# Altium schematic sheet MCU.SchDoc: Wacky Hat MCU
size A3; Author: Jack Duignan; DrawnBy: JDU & EWI; Organization: Group 33; Address1: ECE Department; Address2: University of Canterbury; Address3: Christchurch 8041; Address4: New Zealand; DocumentNumber: 001; Revision: 1; SheetNumber: 1; SheetTotal: 3; ImagePath: \\maxwell\elecapp\AltiumDesigner\Templates\uc-logo.png
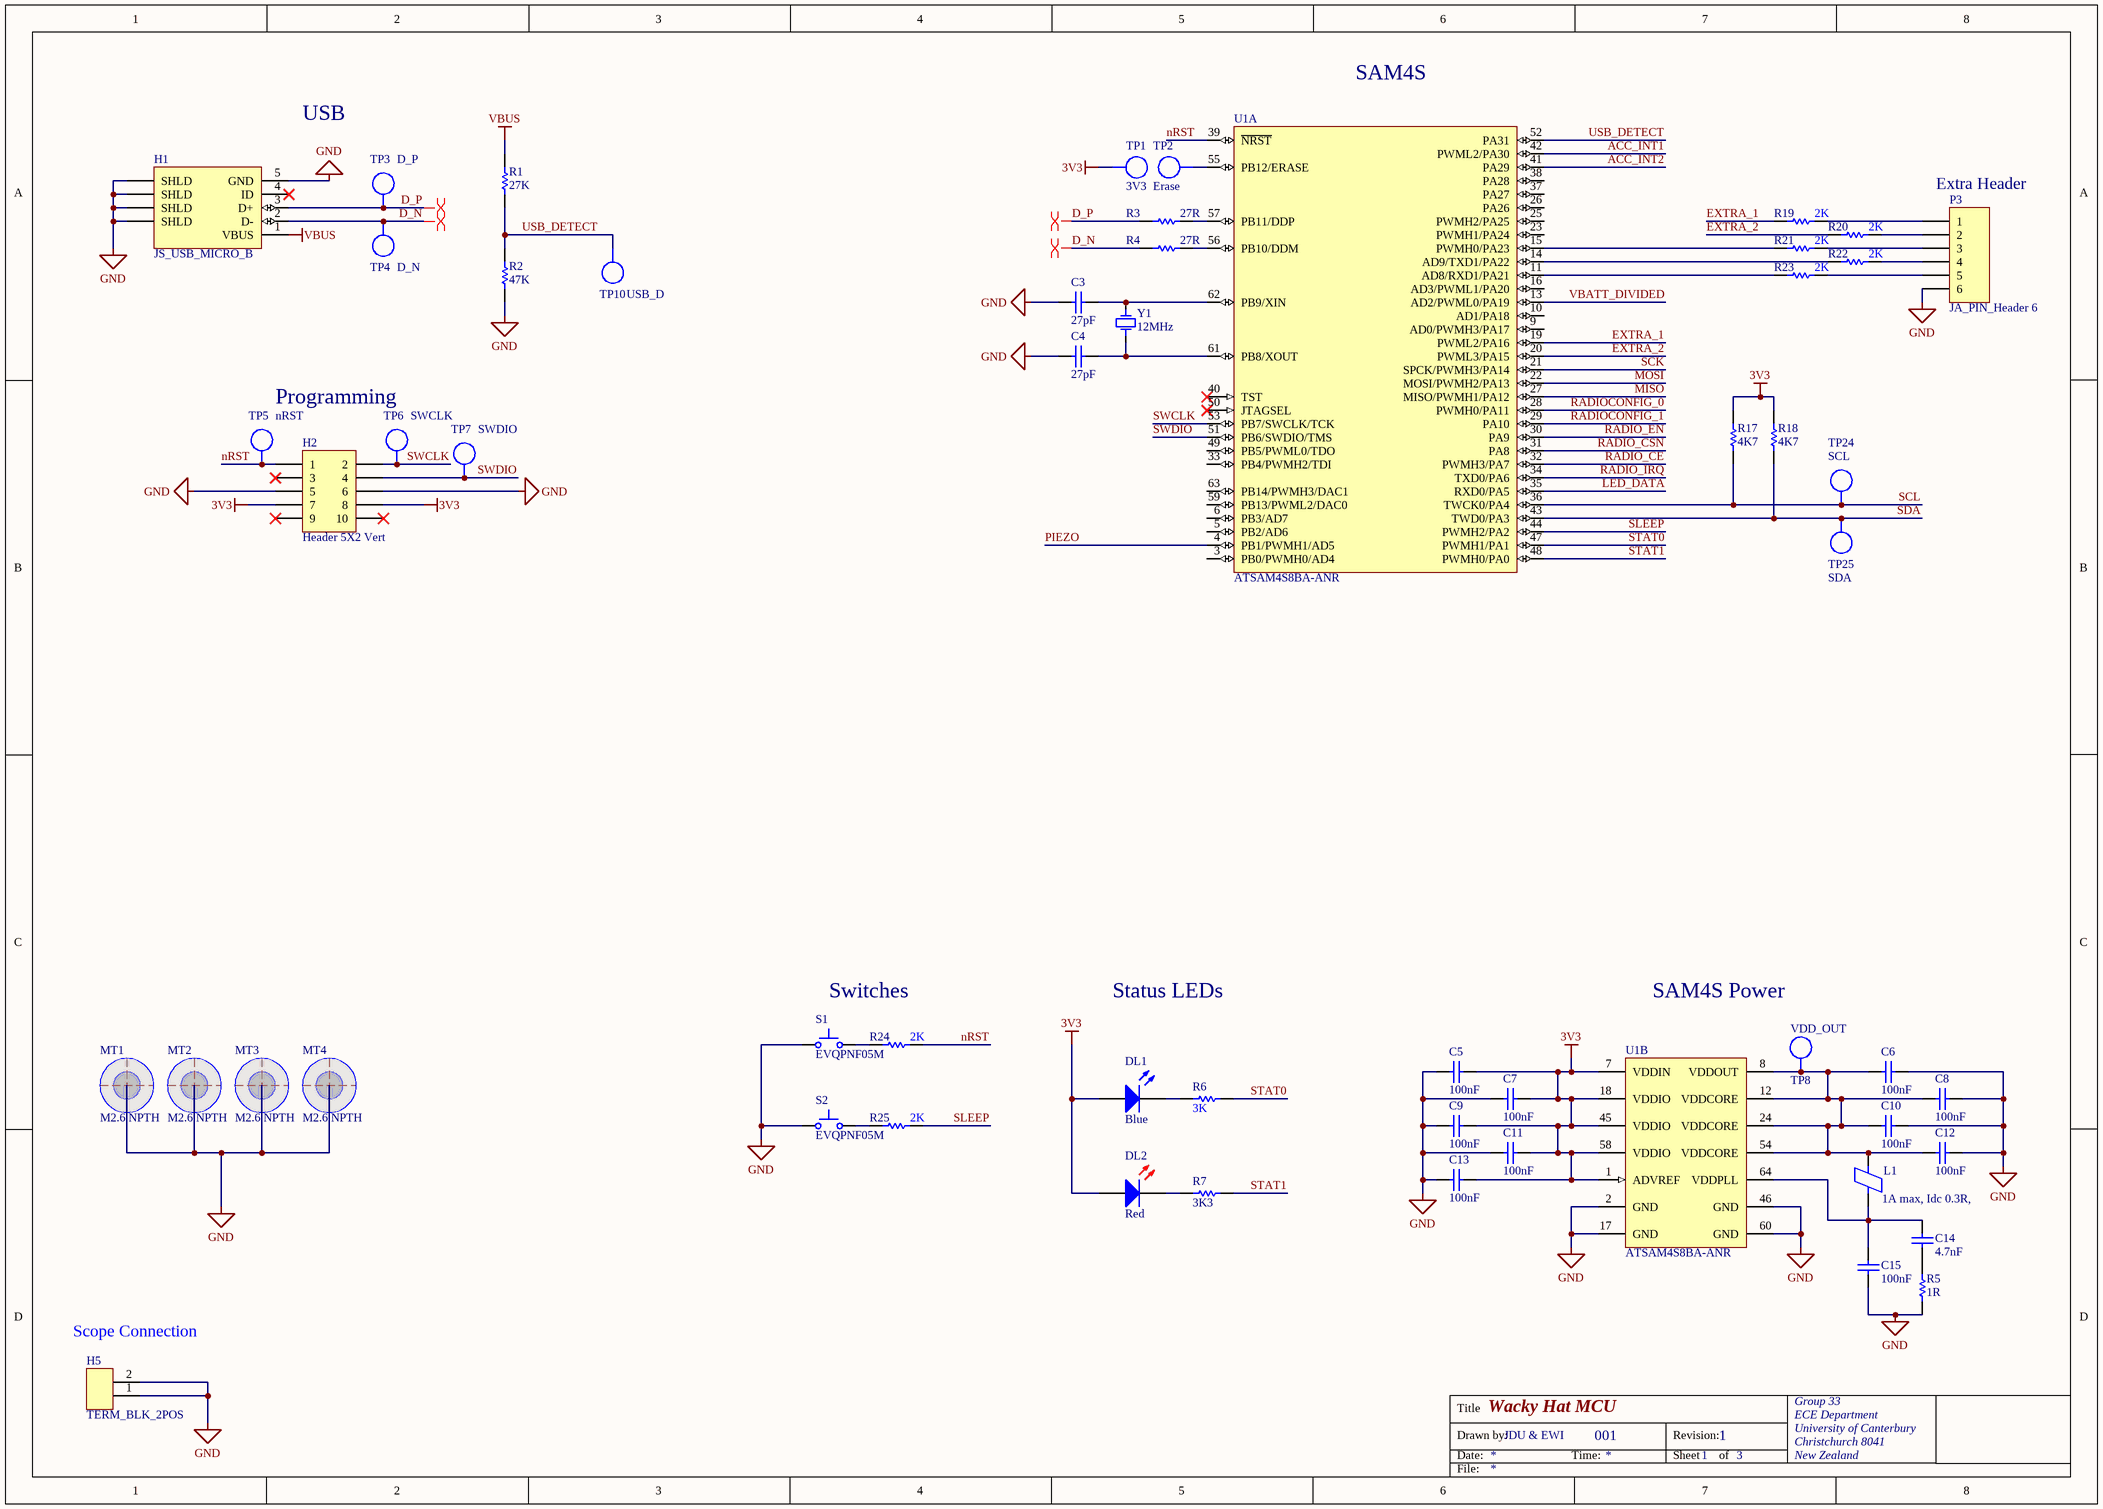
[diagram p0: MCU.SchDoc]

## Parts
C3  27pF  [CAPC1608L]
C4  27pF  [CAPC1608L]
C5  100nF  [CAPC1608L]
C6  100nF  [CAPC1608L]
C7  100nF  [CAPC1608L]
C8  100nF  [CAPC1608L]
C9  100nF  [CAPC1608L]
C10  100nF  [CAPC1608L]
C11  100nF  [CAPC1608L]
C12  100nF  [CAPC1608L]
C13  100nF  [CAPC1608L]
C14  4.7nF  [CAPC1608L]
C15  100nF  [CAPC1608L]
DL1  Blue  [WL-SMCW0603]
DL2  Red  [WL-SMCW0603]
H1  JS_USB_MICRO_B  [FCI_USB_10118194-0001LF]
H2  Header 5X2 Vert  [IDC2.54-V10D]
H5  TERM_BLK_2POS  [TERM_BLK_2POS]
L1  1A max, Idc 0.3R,  [INDC3216L]
MT1  M2.6 NPTH  [MNT-HOLE_2.6mm_NPTH]  (no BOM)
MT2  M2.6 NPTH  [MNT-HOLE_2.6mm_NPTH]  (no BOM)
MT3  M2.6 NPTH  [MNT-HOLE_2.6mm_NPTH]  (no BOM)
MT4  M2.6 NPTH  [MNT-HOLE_2.6mm_NPTH]  (no BOM)
P3  JA_PIN_Header 6  [HDR1X6]
R1  27K  [RESC1608L]
R2  47K  [RESC1608N]
R3  27R  [RESC1608L]
R4  27R  [RESC1608L]
R5  1R  [RESC3216L]
R6  3K  [RESC1608L]
R7  3K3  [RESC1608L]
R17  4K7  [RESC1608L]
R18  4K7  [RESC1608L]
R19  2K  [RESC1608L]
R20  2K  [RESC1608L]
R21  2K  [RESC1608L]
R22  2K  [RESC1608L]
R23  2K  [RESC1608L]
R24  2K  [RESC1608L]
R25  2K  [RESC1608L]
S1  EVQPNF05M  [EVQPNF05M]
S2  EVQPNF05M  [EVQPNF05M]
TP1  3V3  [TP_1206]  (no BOM)
TP2  Erase  [TP_1206]  (no BOM)
TP3  D_P  [TP_1206]  (no BOM)
TP4  D_N  [TP_1206]  (no BOM)
TP5  nRST  [TP_1206]  (no BOM)
TP6  SWCLK  [TP_1206]  (no BOM)
TP7  SWDIO  [TP_1206]  (no BOM)
TP8  VDD_OUT  [TP_1206]  (no BOM)
TP10  USB_D  [TP_1206]  (no BOM)
TP24  SCL  [TP_1206]  (no BOM)
TP25  SDA  [TP_1206]  (no BOM)
U1  ATSAM4S8BA-ANR  [LQFP64_L]  (parts A,B of 2)
Y1  12MHz  [6.0X3.5-4]

## Nets
3V3: C5.2 C7.2 C9.2 C11.2 C13.2 DL1.2(A) DL2.2(A) H2.7 H2.8 R17.2 R18.2 TP1.1 U1.1(ADVREF) U1.7(VDDIN) U1.18(VDDIO) U1.45(VDDIO) U1.58(VDDIO)
GND: C3.1 C4.1 C5.1 C6.2 C7.1 C8.2 C9.1 C10.2 C11.1 C12.2 C13.1 C15.1 H1.5(GND) H1.6(SHLD) H2.5 H2.6 H5.1 H5.2 P3.6 R2.1 R5.1 S1.1 S2.1 U1.2(GND) U1.17(GND) U1.46(GND) U1.60(GND)
VBUS: H1.1(VBUS) R1.2
ACC_INT1: U1.42(PWML2/PA30)
ACC_INT2: U1.41(PA29)
D_N: H1.2(D-) R4.1 TP4.1
D_P: H1.3(D+) R3.1 TP3.1
EXTRA_1: R19.1 U1.19(PWML2/PA16)
EXTRA_2: R20.1 U1.20(PWML3/PA15)
LED_DATA: U1.35(RXD0/PA5)
MISO: U1.27(MISO/PWMH1/PA12)
MOSI: U1.22(MOSI/PWMH2/PA13)
nRST: H2.1 R24.2 TP5.1 U1.39(~{NRST})
PIEZO: U1.4(PB1/PWMH1/AD5)
RADIO_CE: U1.32(PWMH3/PA7)
RADIO_CSN: U1.31(PA8)
RADIO_EN: U1.30(PA9)
RADIO_IRQ: U1.34(TXD0/PA6)
RADIOCONFIG_0: U1.28(PWMH0/PA11)
RADIOCONFIG_1: U1.29(PA10)
SCK: U1.21(SPCK/PWMH3/PA14)
SCL: R17.1 TP24.1 U1.36(TWCK0/PA4)
SDA: R18.1 TP25.1 U1.43(TWD0/PA3)
SLEEP: R25.2 U1.44(PWMH2/PA2)
STAT0: R6.2 U1.47(PWMH1/PA1)
STAT1: R7.2 U1.48(PWMH0/PA0)
SWCLK: H2.2 TP6.1 U1.53(PB7/SWCLK/TCK)
SWDIO: H2.4 TP7.1 U1.51(PB6/SWDIO/TMS)
USB_DETECT: R1.1 R2.2 TP10.1 U1.52(PA31)
VBATT_DIVIDED: U1.13(AD2/PWML0/PA19)
NetC3_2: C3.2 U1.62(PB9/XIN) Y1.3(OSC2)
NetC4_2: C4.2 U1.61(PB8/XOUT) Y1.1(OSC1)
NetC6_1: C6.1 C8.1 C10.1 C12.1 L1.2 TP8.1 U1.8(VDDOUT) U1.12(VDDCORE) U1.24(VDDCORE) U1.54(VDDCORE)
NetC14_1: C14.1 R5.2
NetC14_2: C14.2 C15.2 L1.1 U1.64(VDDPLL)
NetDL1_1: DL1.1(K) R6.1
NetDL2_1: DL2.1(K) R7.1
NetP3_1: P3.1 R19.2
NetP3_2: P3.2 R20.2
NetP3_3: P3.3 R21.2
NetP3_4: P3.4 R22.2
NetP3_5: P3.5 R23.2
NetR3_2: R3.2 U1.57(PB11/DDP)
NetR4_2: R4.2 U1.56(PB10/DDM)
NetR21_1: R21.1 U1.15(PWMH0/PA23)
NetR22_1: R22.1 U1.14(AD9/TXD1/PA22)
NetR23_1: R23.1 U1.11(AD8/RXD1/PA21)
NetR24_1: R24.1 S1.2
NetR25_1: R25.1 S2.2
NetTP2_1: TP2.1 U1.55(PB12/ERASE)

Not connected (* = marked no-connect by the designer): H1 4(ID)*; H2 3* 9* 10*; U1 3(PB0/PWMH0/AD4) 5(PB2/AD6) 6(PB3/AD7) 9(AD0/PWMH3/PA17) 10(AD1/PA18) 16(AD3/PWML1/PA20) 23(PWMH1/PA24) 25(PWMH2/PA25) 26(PA26) 33(PB4/PWMH2/TDI) 37(PA27) 38(PA28) 40(TST)* 49(PB5/PWML0/TDO) 50(JTAGSEL)* 59(PB13/PWML2/DAC0) 63(PB14/PWMH3/DAC1)

## Layout directives
differential pair: D_N, D_P

## Notes on the sheet
- SAM4S
- USB
- (near P3) Extra Header
- Programming
- Switches
- Status LEDs
- SAM4S Power
- (near H5) Scope Connection
- Title
- Drawn by:
- Date:
- Time:
- Revision:
- Sheet
- of
- File:

## Library data of the parts
C3 C4 = CC_27pF_0603: CAP CER 27pF NPO/COG +-5% 50V 0603; PackageReference: 0603; Code_IPC: 1608 [0603]; Verify: *; Supplier: ECE Dept; Storage Location: PCB Assembly WS; Value: 27pF
C5-C13 C15 = CC_100nF_0603: CAP CER 100nF X7R +-10% 50V 0603; PackageReference: 0603; Code_IPC: 1608 [0603]; Verify: *; Supplier: ECE Dept; Storage Location: PCB Assembly WS; Value: 100nF
C14 = CC_4.7nF_0603: CAP CER 4.7nF X7R +-10% 50V 0603; PackageReference: 0603; Code_IPC: 1608 [0603]; Verify: *; Supplier: ECE Dept; Storage Location: PCB Assembly WS; Value: 4.7nF
DL1 = DL_150060BS75000: LED Blue 270mcd 0603 SMD; Manufacturer: WURTH ELEKTRONIK; Forward Current If: 30; Forward Voltage: 3.2; Luminous Intensity: 270; Viewing Angle: 120°; Wavelength Typ: 470; Pricing: 1=0.3844, 50=0.3252, 100=0.2957, 500=0.2365 (NZD); Supplier 1: Farnell; Supplier Part Number 1: 2322069; Manufacturer Part Number: 150060BS75000; Storage Location: PCB Assembly WS; Supplier: ECE Dept; LED Colour: Blue
DL2 = DL_150060RS75000: LED Red 250mcd 0603 SMD; Manufacturer: WURTH ELEKTRONIK; Forward Current If: 30; Forward Voltage: 2; Lens Shape: Rectangular; Luminous Intensity: 250; Wavelength Typ: 625; Viewing Angle: 140°; LED Mounting: SMD; Supplier 1: Farnell; Supplier Part Number 1: 2322071; Manufacturer Part Number: 150060RS75000; Storage Location: PCB Assembly WS; Supplier: ECE Dept; LED Colour: Red
H1 = JS_USB_MICRO_B_SMT: CONN USB MICRO B RECPT SMT R/A; Manufacturer: FCI; Manufacturer Part Number: 10118194-0001LF; Gender: Receptacle; Number of Contacts: 5; Specifications: USB 2.0; Supplier 1: Digi-Key; Supplier Part Number 1: 609-4618-1-ND; Features: Shielded, Solder Retention; Mounting Type: Surface Mount, Right Angle, Horizontal
H2 = JA_HDR_IDC_5X2_VERT: IDC Header, 2,54mm, 10-Pin, Vert; Supplier: ECE Dept; Supplier 1: Farnell; Supplier Part Number 1: 1096985; Storage Location: ECE Dept Store
H5 = TERM_BLK_2POS: 2 Position Terminal Block 7.62mm spacing
L1 = IN_Ferrite-Bead: Ferrite Bead, Rdc 0.3R, Z100MHZ 600R, Imax 1A, SMD 1206; Manufacturer: FAIR-RITE; Manufacturer PN: 2512066017Y1; DC Current Rating: 1; DC Resistance Max: 0.08; Ferrite Case Style: 1206 ^3216 Metric]; Frequency Range: 50MHz to 1; Impedance: 600; Impedance Tolerance: ± 25%; Supplier: ECE Dept; Storage Location: PCB Assembly WS; Ferrite Mounting: SMD; Supplier 1: Farnell; Supplier Part Number 1: 1612060; Manufacturer Part Number: 2512066017Y1; Value: 1A max, Idc 0.3R,
MT1-MT4 = MC_M2.6_HOLE: Fixing M2.6 Mount Hole NPTH; Manufacturer: Hi-Q; Manufacturer PN: 2BV series M2.5 Clearance; price: 0; Supplier: ECE Dept; value: M2.6 NPTH
P3 = JA_PIN_Header 6: Header, 6-Pin; LatestRevisionDate: 17-Jul-2002; LatestRevisionNote: Re-released for DXP Platform.; Publisher: Altium Limited
R1 = RS_27K: RES 27K OHM 1/10W 5% 0603 SMD; Storage Location: PCB Assembly WS; Supplier: ECE Dept; Value: 27K
R2 = RS_47K: RES 47.0K OHM 1/10W 5% 0603 SMD; Storage Location: PCB Assembly WS; Supplier: ECE Dept; Value: 47K
R3 R4 = RS_27R: RES 27 OHM 1/10W 5% 0603 SMD; Storage Location: PCB Assembly WS; Supplier: ECE Dept; Value: 27R
R5 = RT_1R: RES 1R OHM 1/4W 5% 1206 SMD; Storage Location: PCB Assembly WS; Supplier: ECE Dept; Value: 1R
R6 = RS_3K: RES 3K OHM 1/10W 5% 0603 SMD; Storage Location: PCB Assembly WS; Supplier: ECE Dept; Value: 3K
R7 = RS_1K5: RES 1.5K OHM 1/10W 5% 0603 SMD; Storage Location: PCB Assembly WS; Supplier: ECE Dept; Value: 3K3
R17 R18 = RS_4K7: RES 4.7K OHM 1/10W 5% 0603 SMD; Storage Location: PCB Assembly WS; Supplier: ECE Dept; Value: 4K7
R19-R25 = RS_2K: RES 2K OHM 1/10W 5% 0603 SMD; Storage Location: PCB Assembly WS; Supplier: ECE Dept; Value: 2K
S1 S2 = WS_EVQPNF05M: Panasonic 6 x 3.5mm SMD Light Touch Switch Type SMD; PackageDescription: 6.0 x 3.5 mm; Supplier 1: Farnell; Supplier Part Number 1: 2079481; Manufacturer: Panasonic; Manufacturer PN: EVQPNF05M; Supplier 2: Digi-Key; Supplier Part Number 2: P13598SCT-ND; Storage Location: PCB Assembly WS; Supplier: ECE Dept
TP1-TP8 TP10 TP24 TP25 = TP_1206: Test-Point 3.3x1.6x2.1mm SMD; Manufacturer: Harwin Inc; Manufacturer Part Number: S1751-46R; Value: TP; Manufacturer PN: *; Storage Location: ProtoPlace; Mounting Type: Surface Mount; Type: PC Test Point; Supplier 1: Digi-Key; Supplier Part Number 1: 952-1478-2-ND; Supplier 2: Farnell; Supplier Part Number 2: 1826282; Supplier: ECE Dept
U1 = SE_ATSAM4S16BA-MU: IC MCU 32BIT 512KB FLASH 64LQFP; Manufacturer: Atmel; Connectivity: I²C, IrDA, Memory Card, SPI, SSC, UART/USART, USB; Core Processor: ARM® Cortex®-M4; Core Size: 32-Bit; Data Converters: A/D 11x12b, D/A 2x12b; Number of I/O: 47; Peripherals: Brown-out Detect/Reset, DMA, POR, PWM, WDT; Program Memory Size: 512KB (512K x 8); RAM Size: 128K x 8; Speed: 120MHz; Voltage - Supply (Vcc/Vdd): 1.62 V ~ 3.6 V; PackageVersion: revJ, Jul-2007; PackageReference: 64PS; PackageDescription: 64-Pin Quad Flat No-Lead (QFN) Sawn, 9 x 9 x 1.0 mm Body, 0.5 mm Pitch, Exposed Pad; Code_JEDEC: MO-220VMMD-3; ComponentLink1Description: Manufacturer URL; ComponentLink1URL: http://www.atmel.com/; ComponentLink2Description: SAM4S Series Datasheet; ComponentLink2URL: http://www.atmel.com/dyn/resources/prod_documents/11100.pdf; ComponentLink3Description: SAM4S Series Summary; ComponentLink3URL: http://www.atmel.com/dyn/resources/prod_documents/11100S.pdf; Supplier 1: Digi-Key; Package / Case: 64-LQFP; Packaging: Cut Tape (CT); Program Memory Type: FLASH; Supplier Part Number 1: ATSAM4S8BA-ANRCT-ND; Manufacturer Part Number: ATSAM4S8BA-ANR
Y1 = XT_CRYSTAL_12MHz_18pF: CRYSTAL 12MHZ 18PF 6X3.5mm SMD; Manufacturer: CTS-Frequency Controls; Manufacturer Part Number: 406C35D12M00000; ESR (Equivalent Series Resistance): 60 Ohm; Frequency Stability: ±50ppm; Frequency Tolerance: ±30ppm; Operating Mode: Fundamental; Supplier 1: Digi-Key; Height: 0.047" (1.20mm); Load Capacitance: 18pF; Mounting Type: Surface Mount; Operating Temperature: -20°C ~ 70°C; Package / Case: 4-SMD, No Lead (DFN, LCC); Size / Dimension: 0.236" L x 0.138" W (6.00mm x 3.50mm); Supplier Part Number 1: CTX855CT-ND; Frequency: 12MHz